# Altium schematic sheet CRSC0001.SchDoc
size A4
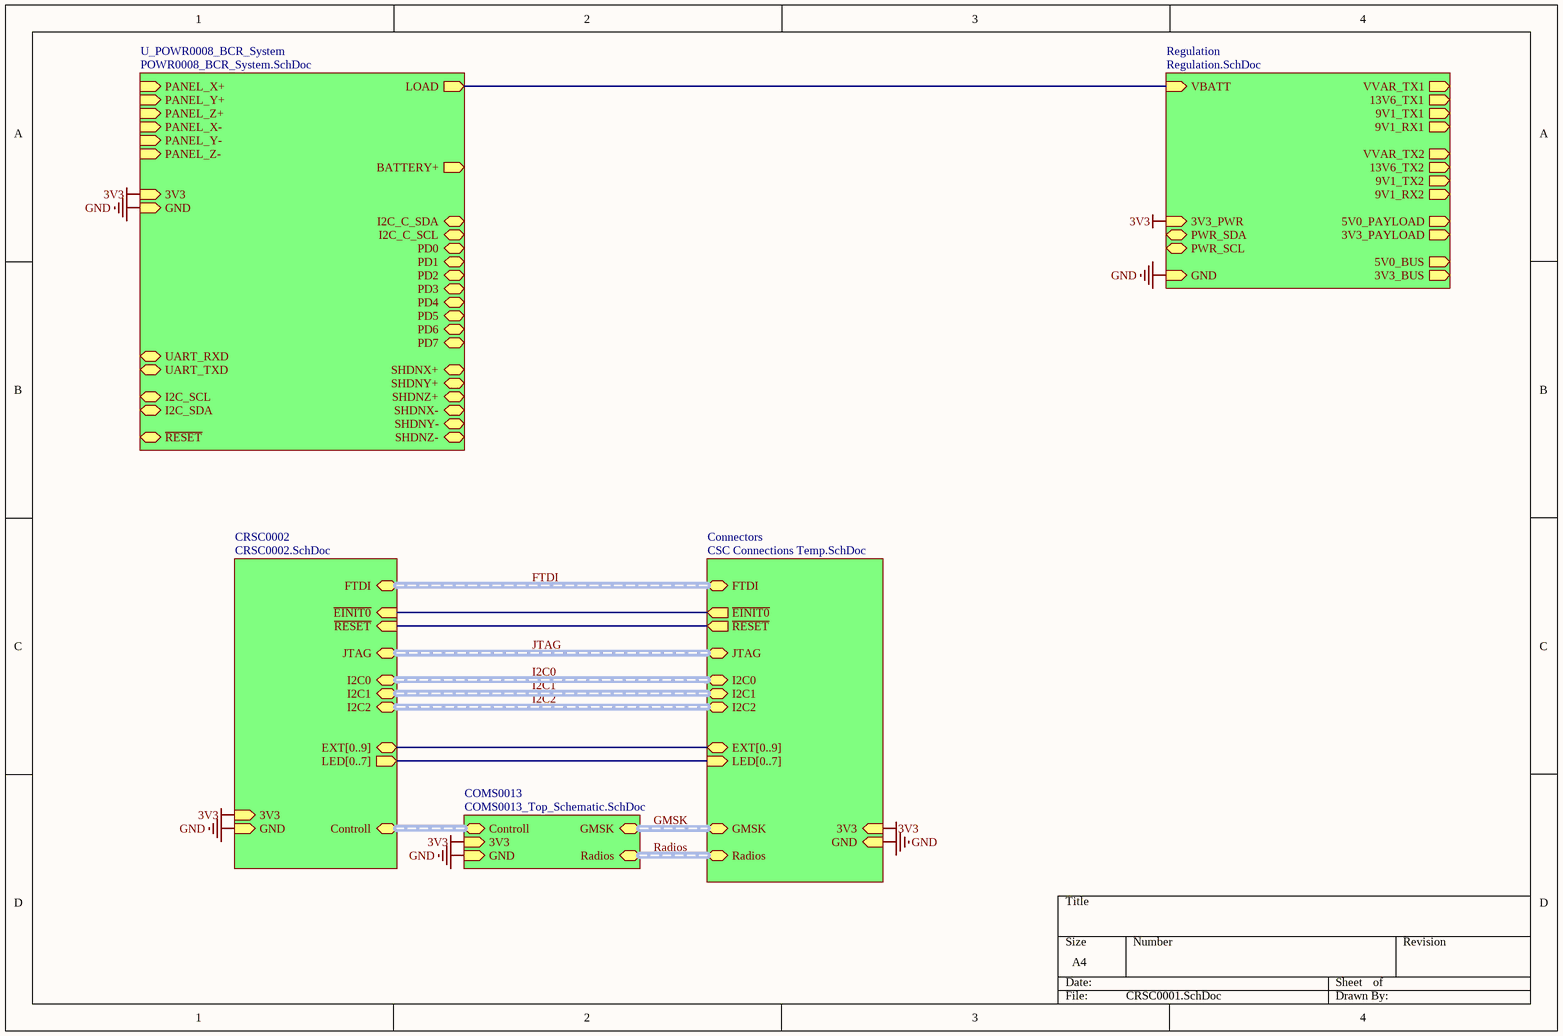
[diagram p0: CRSC0001.SchDoc]

## Sub-sheets
COMS0013 = COMS0013_Top_Schematic.SchDoc: GMSK (harness GMSK), Radios (harness Radios), Controll (harness CommsControll), 3V3 (in), GND (in)
Connectors = CSC Connections Temp.SchDoc: JTAG (harness JTAG), FTDI (harness FTDI), I2C0 (harness I2C), I2C1 (harness I2C), I2C2 (harness I2C), GMSK (harness GMSK), Radios (harness Radios), EXT[0..9] (bidir), LED[0..7] (in), ~{EINIT0} (out), ~{RESET} (out), 3V3 (in), GND (in)
CRSC0002 = CRSC0002.SchDoc: ~{EINIT0} (in), ~{RESET} (in), I2C1 (harness I2C), I2C0 (harness I2C), I2C2 (harness I2C), JTAG (harness JTAG), Controll (harness CommsControll), FTDI (harness FTDI), EXT[0..9] (bidir), LED[0..7] (out), 3V3 (in), GND (in)
Regulation = Regulation.SchDoc: VBATT (in), GND (in), PWR_SDA (bidir), PWR_SCL (bidir), 3V3_PWR (in), 3V3_BUS (out), 3V3_PAYLOAD (out), 5V0_BUS (out), 5V0_PAYLOAD (out), 9V1_RX1 (out), 9V1_RX2 (out), 9V1_TX1 (out), 9V1_TX2 (out), 13V6_TX1 (out), 13V6_TX2 (out), VVAR_TX1 (out), VVAR_TX2 (out)
U_POWR0008_BCR_System = POWR0008_BCR_System.SchDoc: PANEL_X+ (in), PANEL_Y+ (in), PANEL_Z+ (in), PANEL_X- (in), PANEL_Y- (in), PANEL_Z- (in), UART_RXD (bidir), UART_TXD (bidir), LOAD (out), BATTERY+ (out), 3V3 (in), GND (in), SHDNX+ (bidir), SHDNY+ (bidir), SHDNZ+ (bidir), SHDNX- (bidir), SHDNY- (bidir), SHDNZ- (bidir), I2C_SCL (bidir), I2C_SDA (bidir), ~{RESET} (bidir), PD0 (bidir), PD1 (bidir), PD2 (bidir), PD3 (bidir), PD4 (bidir), PD5 (bidir), PD6 (bidir), PD7 (bidir), I2C_C_SDA (bidir), I2C_C_SCL (bidir)

## Nets
3V3: sheet CRSC0002/3V3, sheet COMS0013/3V3, sheet Connectors/3V3, sheet U_POWR0008_BCR_System/3V3, sheet Regulation/3V3_PWR
GND: sheet CRSC0002/GND, sheet COMS0013/GND, sheet Connectors/GND, sheet U_POWR0008_BCR_System/GND, sheet Regulation/GND
(unnamed): sheet CRSC0002/~{EINIT0}, sheet Connectors/~{EINIT0}
(unnamed): sheet CRSC0002/~{RESET}, sheet Connectors/~{RESET}
(unnamed): sheet U_POWR0008_BCR_System/LOAD, sheet Regulation/VBATT

## Buses and harness runs
bus sheet Connectors/EXT[0..9] = sheet CRSC0002/EXT[0..9]
bus sheet Connectors/LED[0..7] = sheet CRSC0002/LED[0..7]
harness FTDI = sheet Connectors/FTDI = sheet CRSC0002/FTDI
harness GMSK = sheet COMS0013/GMSK = sheet Connectors/GMSK
harness I2C0 = sheet Connectors/I2C0 = sheet CRSC0002/I2C0
harness I2C1 = sheet Connectors/I2C1 = sheet CRSC0002/I2C1
harness I2C2 = sheet Connectors/I2C2 = sheet CRSC0002/I2C2
harness JTAG = sheet Connectors/JTAG = sheet CRSC0002/JTAG
harness Radios = sheet COMS0013/Radios = sheet Connectors/Radios
harness sheet COMS0013/Controll = sheet CRSC0002/Controll